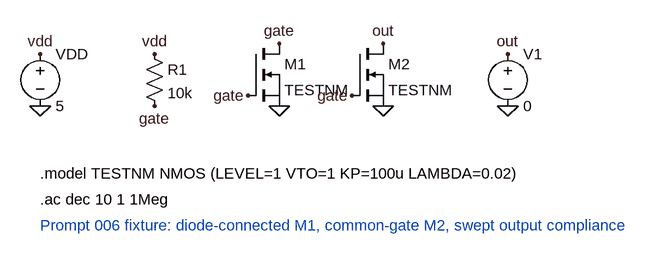
[diagram p0: schematic dc_current_mirror.asc]
dc_current_mirror.asc, the LTspice schematic file:
Version 4
SHEET 1 1200 680
FLAG 0 16 vdd
FLAG 0 96 0
FLAG 176 16 vdd
FLAG 176 96 gate
FLAG 368 0 gate
FLAG 320 80 gate
FLAG 368 96 0
FLAG 528 0 out
FLAG 480 80 gate
FLAG 528 96 0
FLAG 720 16 out
FLAG 720 96 0
SYMBOL voltage 0 0 R0
SYMATTR InstName VDD
SYMATTR Value 5
SYMBOL res 160 0 R0
SYMATTR InstName R1
SYMATTR Value 10k
SYMBOL nmos 320 0 R0
SYMATTR InstName M1
SYMATTR Value TESTNM
SYMATTR SpiceLine L=10u W=100u
SYMBOL nmos 480 0 R0
SYMATTR InstName M2
SYMATTR Value TESTNM
SYMATTR SpiceLine L=10u W=100u
SYMBOL voltage 720 0 R0
SYMATTR InstName V1
SYMATTR Value 0
TEXT 0 200 Left 2 !.model TESTNM NMOS (LEVEL=1 VTO=1 KP=100u LAMBDA=0.02)
TEXT 0 240 Left 2 !.ac dec 10 1 1Meg
TEXT 0 280 Left 2 ;Prompt 006 fixture: diode-connected M1, common-gate M2, swept output compliance

The netlist it stands for:
* dc_current_mirror.asc
VDD vdd 0 5
R1 vdd gate 10k
M1 gate gate 0 0 TESTNM L=10u W=100u
M2 out gate 0 0 TESTNM L=10u W=100u
V1 out 0 0
.model NMOS NMOS
.model PMOS PMOS
.lib standard.mos
.model TESTNM NMOS (LEVEL=1 VTO=1 KP=100u LAMBDA=0.02)
.ac dec 10 1 1Meg
* Prompt 006 fixture: diode-connected M1, common-gate M2, swept output compliance
.backanno
.end